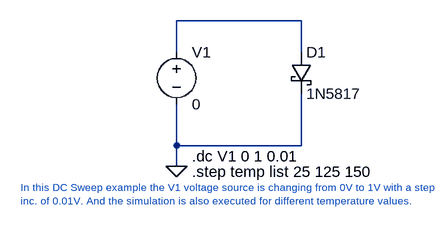
[diagram p0: schematic Sweep Voltage for I-V Curve of a Diode Under Various Junc Temp-3.asc]
Sweep Voltage for I-V Curve of a Diode Under Various Junc Temp-3.asc, the LTspice schematic file:
Version 4
SHEET 1 880 680
WIRE 240 64 48 64
WIRE 48 112 48 64
WIRE 240 112 240 64
WIRE 48 256 48 192
WIRE 240 256 240 176
WIRE 240 256 48 256
WIRE 48 288 48 256
FLAG 48 288 0
SYMBOL voltage 48 96 R0
WINDOW 123 0 0 Left 0
WINDOW 39 0 0 Left 0
SYMATTR InstName V1
SYMATTR Value 0
SYMBOL schottky 224 112 R0
SYMATTR InstName D1
SYMATTR Value 1N5817
SYMATTR Description Diode
SYMATTR Type diode
TEXT 72 272 Left 2 !.dc V1 0 1 0.01
TEXT -192 320 Left 1 ;In this DC Sweep example the V1 voltage source is changing from 0V to 1V with a step \ninc. of 0.01V. And the simulation is also executed for different temperature values.
TEXT 72 296 Left 2 !.step temp list 25 125 150

The netlist it stands for:
* Sweep Voltage for I-V Curve of a Diode Under Various Junc Temp-3.asc
V1 N001 0 0
D1 N001 0 1N5817
.model D D
.lib standard.dio
.dc V1 0 1 0.01
* In this DC Sweep example the V1 voltage source is changing from 0V to 1V with a step
* inc. of 0.01V. And the simulation is also executed for different temperature values.
.step temp list 25 125 150
.backanno
.end